# Altium schematic sheet FPGA_MGT.SchDoc
size A4; SheetNumber: 4; SheetTotal: 8
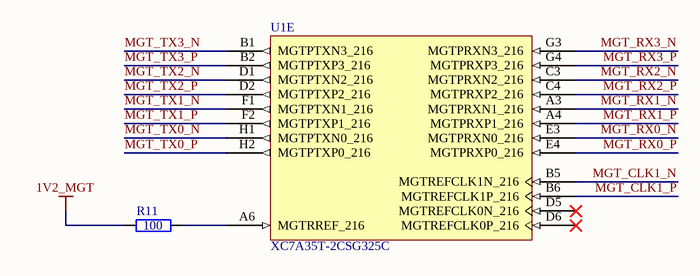
[diagram p0: FPGA_MGT.SchDoc]

## Parts
R11  100  [GEN_R_0402]
U1  XC7A35T-2CSG325C  [CSG325]  (part E of 9)

## Nets
1V2_MGT: R11.1
MGT_CLK1_N: U1.B5(MGTREFCLK1N_216)
MGT_CLK1_P: U1.B6(MGTREFCLK1P_216)
MGT_RX0_N: U1.E3(MGTPRXN0_216)
MGT_RX0_P: U1.E4(MGTPRXP0_216)
MGT_RX1_N: U1.A3(MGTPRXN1_216)
MGT_RX1_P: U1.A4(MGTPRXP1_216)
MGT_RX2_N: U1.C3(MGTPRXN2_216)
MGT_RX2_P: U1.C4(MGTPRXP2_216)
MGT_RX3_N: U1.G3(MGTPRXN3_216)
MGT_RX3_P: U1.G4(MGTPRXP3_216)
MGT_TX0_N: U1.H1(MGTPTXN0_216)
MGT_TX0_P: U1.H2(MGTPTXP0_216)
MGT_TX1_N: U1.F1(MGTPTXN1_216)
MGT_TX1_P: U1.F2(MGTPTXP1_216)
MGT_TX2_N: U1.D1(MGTPTXN2_216)
MGT_TX2_P: U1.D2(MGTPTXP2_216)
MGT_TX3_N: U1.B1(MGTPTXN3_216)
MGT_TX3_P: U1.B2(MGTPTXP3_216)
NetR11_2: R11.2 U1.A6(MGTRREF_216)

Not connected (* = marked no-connect by the designer): U1 D5(MGTREFCLK0N_216)* D6(MGTREFCLK0P_216)*

## Library data of the parts
R11 = RES 100 OHM 1% 1/10W 0402: Tolerance: 1%; Power Rating: 0.1W; Package: 0402; Value: 100; Supplier 1: Digi-Key; Supplier Part Number 1: 2019-RK73H1ETTP1000FCT-ND
U1 = XC7A35T-2CSG325C: Artix-7 FPGA, 150 User I/Os, 4 GTP, 324-Ball BGA, Speed Grade 2, Commercial Grade, Pb-Free; Manufacturer: Xilinx; Total Block RAM: 1800 Kb; GTP: 4; Clock Mgmt Tiles (CMTs): 5; Logic Cells: 33280; Available User I/O: 150; Speed Grades: 2; DatasheetVersion: v1.15; PackageVersion: Rev. 1.11; PackageReference: CSG-325; PackageDescription: 324-Ball Wire-Bond Chip-Scale BGA, Body 15 x 15 mm, Pitch 0.8 mm; Maximum Distributed RAM: 400 Kb; Operating Temperature Range: Commercial; NexusDeviceID: XC7A35T-2CSG325C; Mounting Technology: Surface Mount; PartNumber: XC7A35T-2CSG325C; ComponentLink1Description: Manufacturer URL; ComponentLink1URL: http://www.xilinx.com/; ComponentLink2Description: Datasheet; ComponentLink2URL: http://www.xilinx.com/support/documentation/data_sheets/ds180_7Series_Overview.pdf; ComponentLink3Description: Package Specification; ComponentLink3URL: http://www.xilinx.com/support/documentation/user_guides/ug475_7Series_Pkg_Pinout.pdf; ComponentLink4Description: DC and Switching Characteristics; ComponentLink4URL: http://www.xilinx.com/support/documentation/data_sheets/ds181_Artix_7_Data_Sheet.pdf; ComponentLink5Description: Package File; ComponentLink5URL: http://www.xilinx.com/support/packagefiles/a7packages/xc7a200tsbg484pkg.txt; ComponentLink6Description: Packaging and Pinout; ComponentLink6URL: http://www.xilinx.com/support/documentation/user_guides/ug475_7Series_Pkg_Pinout.pdf